# Altium schematic sheet tc_tp6_ej3.SchDoc
size A
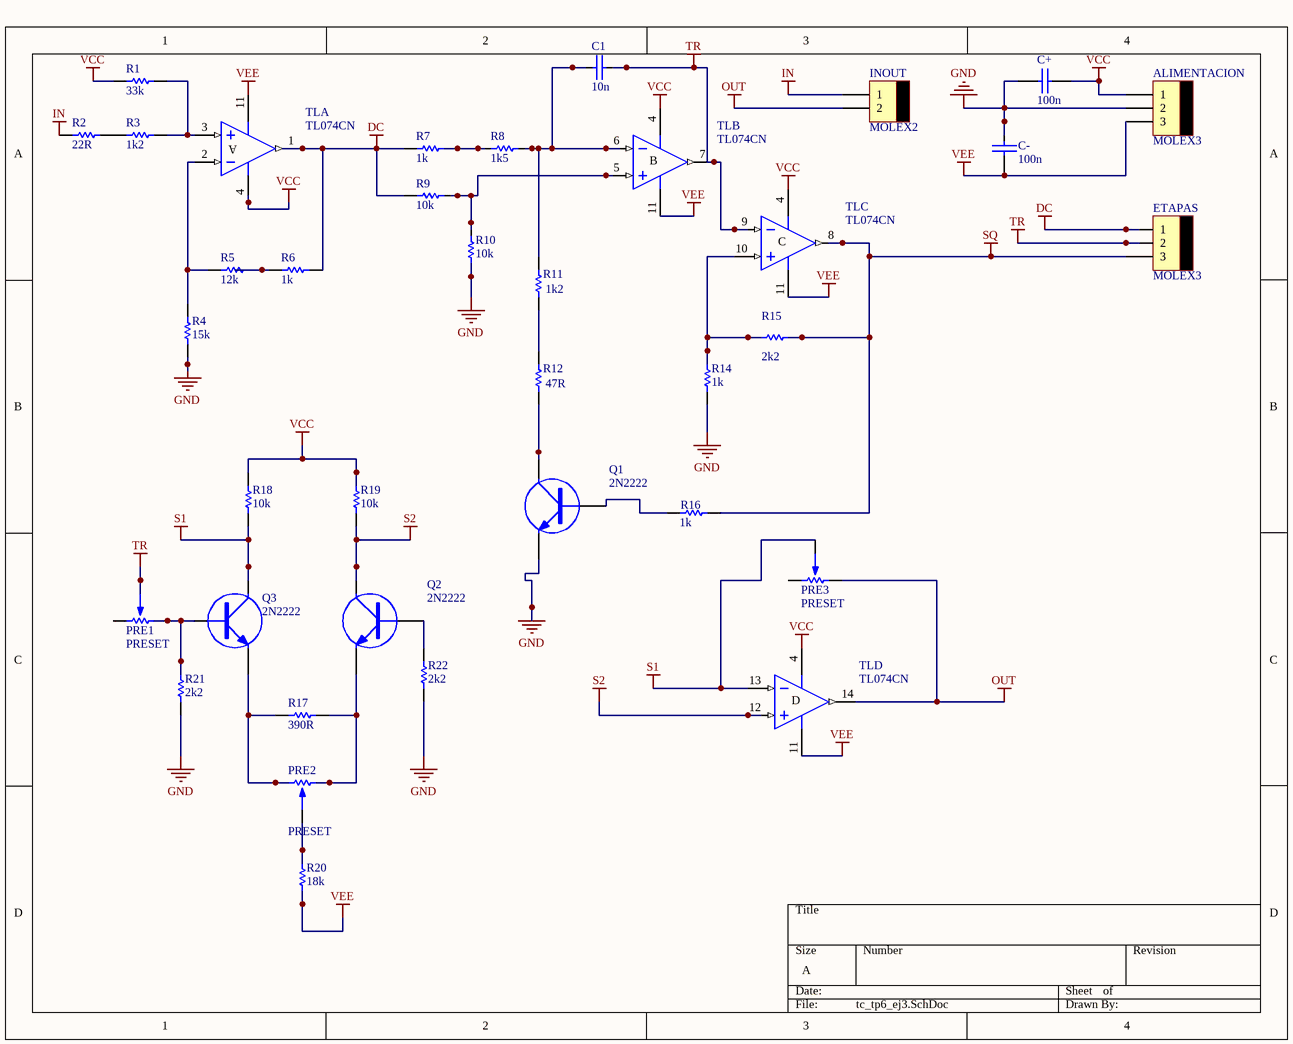
[diagram p0: tc_tp6_ej3.SchDoc]

## Parts
ALIMENTACION  MOLEX3  [MOLEX3]
C1  10n  [CAP200]
C+  100n  [CAP200]
C-  100n  [CAP200]
ETAPAS  MOLEX3  [MOLEX3]
INOUT  MOLEX2  [MOLEX2]
PRE1  PRESET  [PRESET V]
PRE2  PRESET  [PRESET V]
PRE3  PRESET  [PRESET V]
Q1  2N2222  [TO92]
Q2  2N2222  [TO92]
Q3  2N2222  [TO92]
R1  33k  [RES400]
R2  22R  [RES400]
R3  1k2  [RES400]
R4  15k  [RES400]
R5  12k  [RES400]
R6  1k  [RES400]
R7  1k  [RES400]
R8  1k5  [RES400]
R9  10k  [RES400]
R10  10k  [RES400]
R11  1k2  [RES400]
R12  47R  [RES400]
R14  1k  [RES400]
R15  2k2  [RES400]
R16  1k  [RES400]
R17  390R  [RES400]
R18  10k  [RES400]
R19  10k  [RES400]
R20  18k  [RES400]
R21  2k2  [RES400]
R22  2k2  [RES400]
TL  TL074CN  [DIP14]  (parts A,B,C,D of 4)

## Nets
DC: ETAPAS.1 R6.1 R7.2 R9.1 TL.1(OUT)
GND: ALIMENTACION.2 C+.1 C-.2 Q1.2(E) R4.1 R10.1 R14.1 R21.1 R22.1
IN: INOUT.1 R2.1
OUT: INOUT.2 PRE3.3 TL.14(OUT)
S1: PRE3.2 Q3.3(C) R18.1 TL.13(IN-)
S2: Q2.3(C) R19.1 TL.12(IN+)
SQ: ETAPAS.3 R15.1 R16.1 TL.8(OUT)
TR: C1.2 ETAPAS.2 PRE1.2 TL.7(OUT) TL.9(IN-)
VCC: ALIMENTACION.1 C+.2 R1.1 R18.2 R19.2 TL.4(V+)
VEE: ALIMENTACION.3 C-.1 R20.1 TL.11(V-)
NetC1_1: C1.1 R8.1 R11.2 TL.6(IN-)
NetPRE1_3: PRE1.3 Q3.1(B) R21.2
NetPRE2_1: PRE2.1 Q2.2(E) R17.2
NetPRE2_2: PRE2.2 R20.2
NetPRE2_3: PRE2.3 Q3.2(E) R17.1
NetQ1_1: Q1.1(B) R16.2
NetQ1_3: Q1.3(C) R12.1
NetQ2_1: Q2.1(B) R22.2
NetR1_2: R1.2 R3.2 TL.3(IN+)
NetR2_2: R2.2 R3.1
NetR4_2: R4.2 R5.2 TL.2(IN-)
NetR5_1: R5.1 R6.2
NetR7_1: R7.1 R8.2
NetR9_2: R9.2 R10.2 TL.5(IN+)
NetR11_1: R11.1 R12.2
NetR14_2: R14.2 R15.2 TL.10(IN+)

Not connected (* = marked no-connect by the designer): PRE1 1; PRE3 1

## Notes on the sheet
- (in symbol TL074CN, part A) A
- (in symbol TL074CN, part B) B
- (in symbol TL074CN, part C) C
- (in symbol TL074CN, part D) D

## Library data of the parts
C1 C+ C- = CAP
R1-R12 R14-R22 = RES
TL = TL074CN: Low-Noise J-FET Quad Operational Amplifier; Published: 24-Aug-2001; LatestRevisionDate: 06-Jun-2005; LatestRevisionNote: Stylized 3D Model Added.; DatasheetVersion: Dec-1998; PackageVersion: Jan-1997; PackageReference: DIP14; Publisher: Altium Limited; PackageDescription: DIP; 14 Leads; Row Spacing 7.62 mm; Pitch 2.54 mm; ComponentLink1Description: Manufacturer Link; ComponentLink1URL: http://www.st.com/; ComponentLink2Description: Datasheet; ComponentLink2URL: http://www.st.com/stonline/products/literature/ds/2297/tl074.pdf